# Altium project STM32F427IIH6.PrjPcb
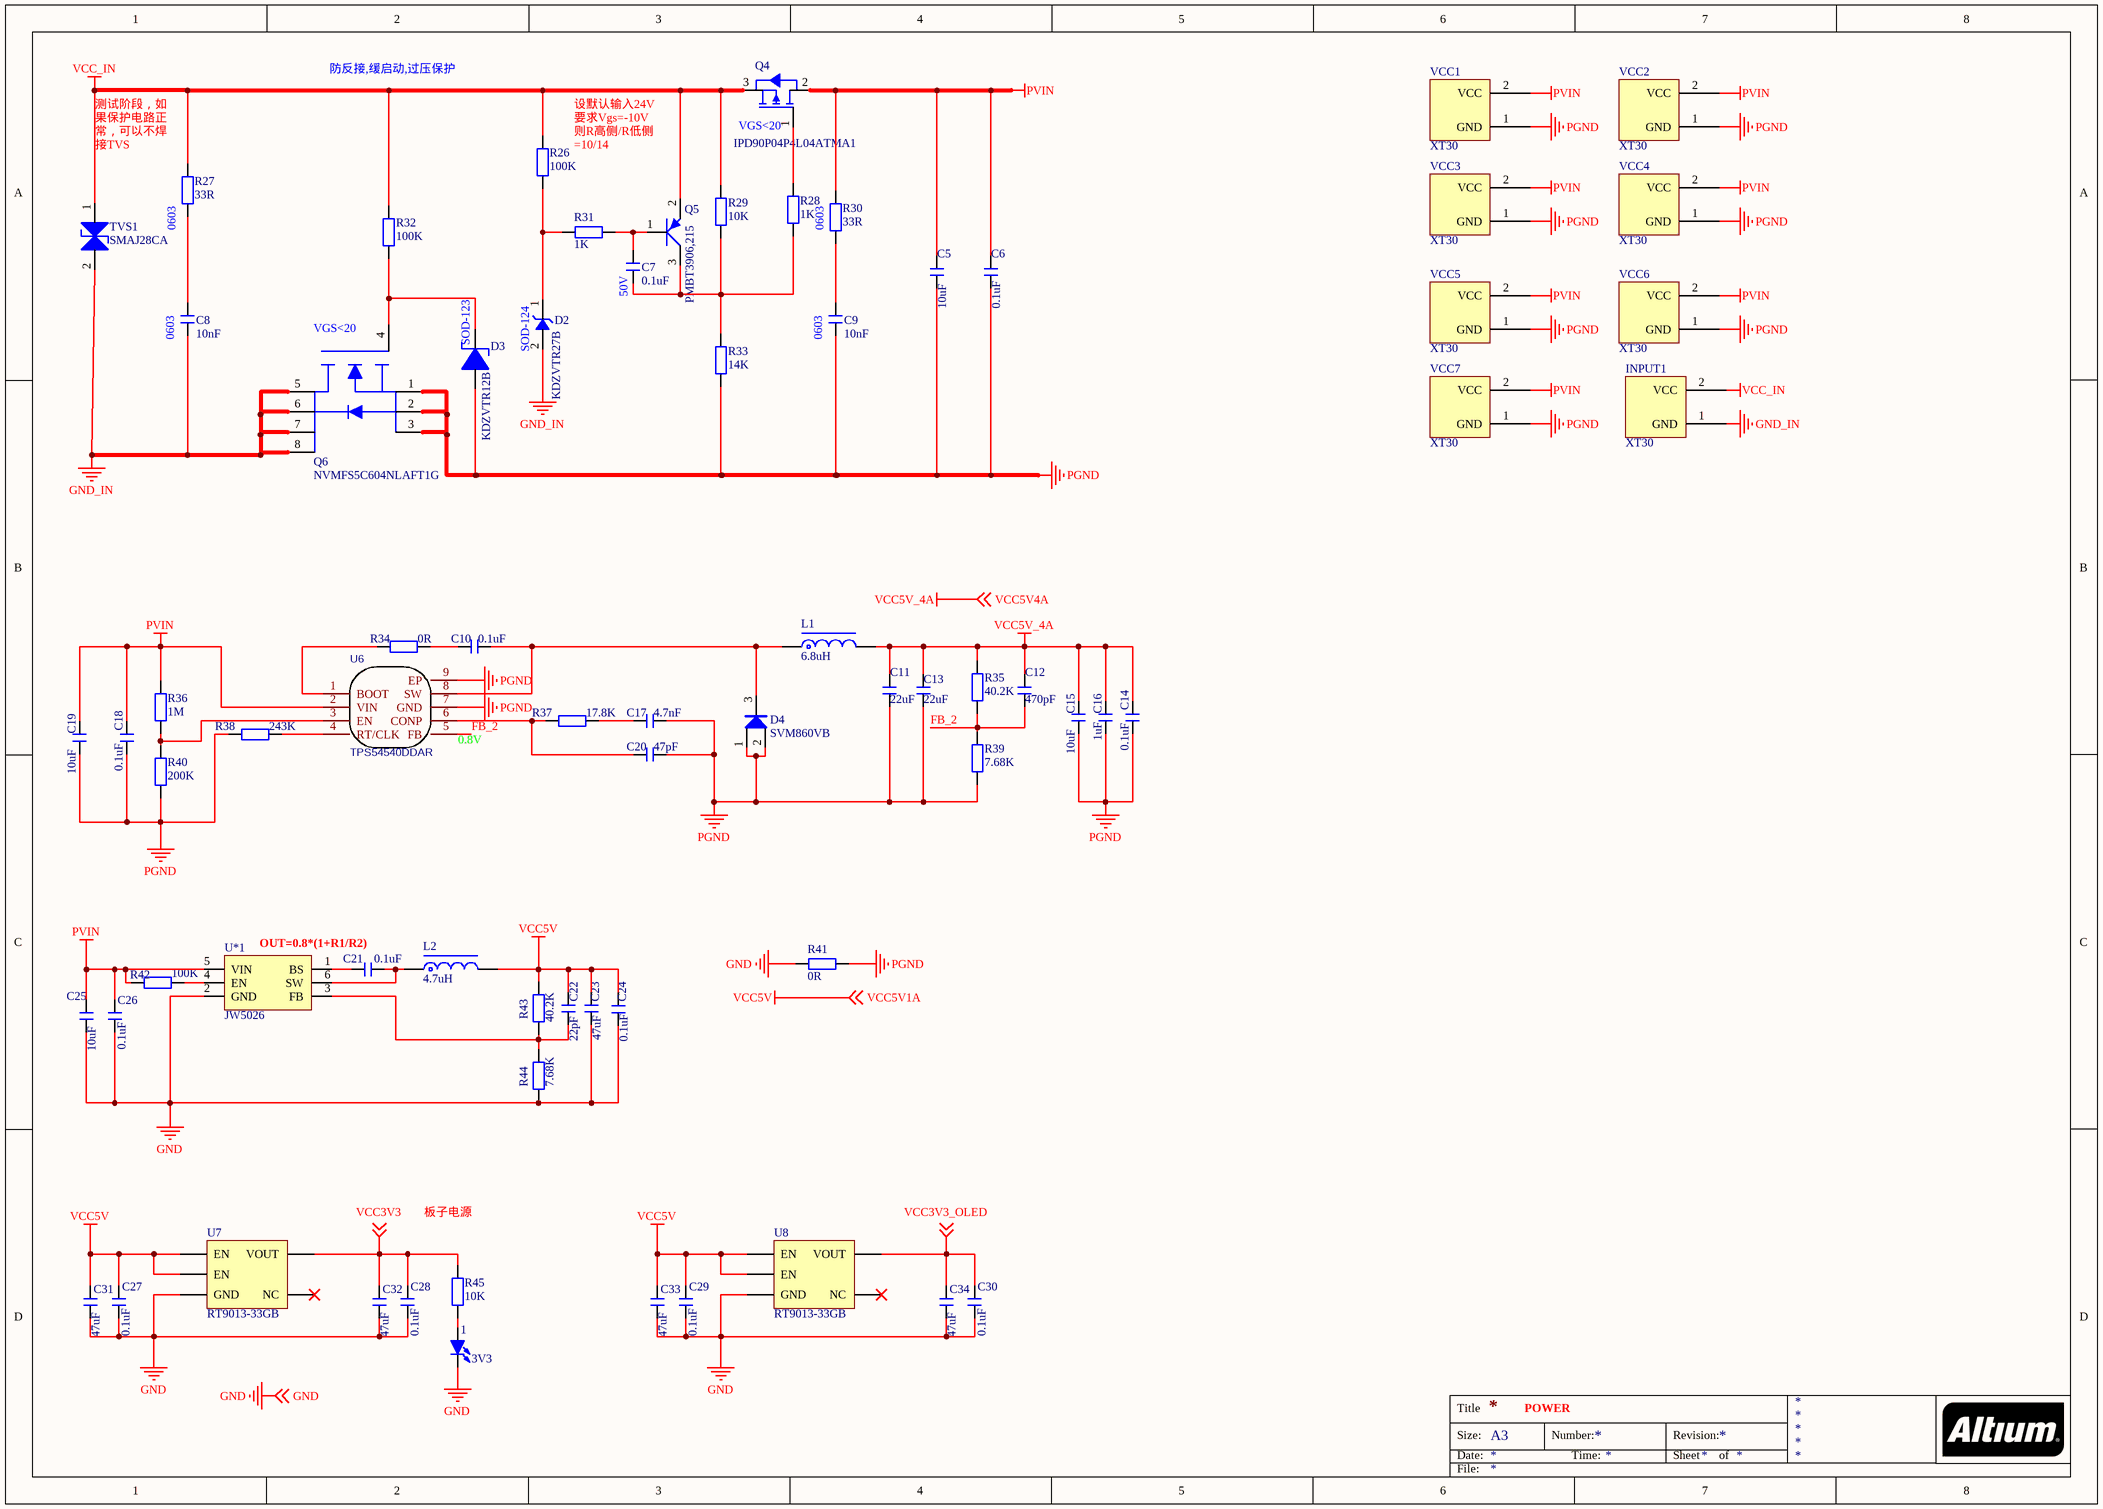
[diagram p0: Power.SchDoc]
1 sheet, 72 parts. Net scope: global (net labels, ports and power ports of the same name join across sheets).
Board file: STM32F427IIH6.PcbDoc

## Sheet Power.SchDoc
size A3

### Parts
1  3V3  [LED 0805R]
C5  10uF  [C 0805_L]
C6  0.1uF  [C 0805_L]
C7  0.1uF  [C 0402_L]
C8  10nF  [C 0402_L]
C9  10nF  [C 0402_L]
C10  0.1uF  [C 0402_L]
C11  22uF  [C 0805_L]
C12  470pF  [C 0402_L]
C13  22uF  [C 0805_L]
C14  0.1uF  [C 0805_L]
C15  10uF  [C 0805_L]
C16  1uF  [C 0805_L]
C17  4.7nF  [C 0402_L]
C18  0.1uF  [C 0805_L]
C19  10uF  [C 0805_L]
C20  47pF  [C 0402_L]
C21  0.1uF  [C 0402_L]
C22  22pF  [C 0402_L]
C23  47uF  [C 0805_L]
C24  0.1uF  [C 0805_L]
C25  10uF  [C 0805_L]
C26  0.1uF  [C 0805_L]
C27  0.1uF  [C 0805_L]
C28  0.1uF  [C 0805_L]
C29  0.1uF  [C 0805_L]
C30  0.1uF  [C 0805_L]
C31  47uF  [C 0805_L]
C32  47uF  [C 0805_L]
C33  47uF  [C 0805_L]
C34  47uF  [C 0805_L]
D2  KDZVTR27B  [SOD-123_L2.8-W1.8-LS3.7-RD]
D3  KDZVTR12B  [SOD-123_L2.8-W1.8-LS3.7-RD]
D4  SVM860VB  [TO-277B_3P-L6.1-W4.3-LS7.0-BR]
INPUT1  XT30  [XT30PW-M]
L1  6.8uH  [CDRH73]
L2  4.7uH  [CD53]
Q4  IPD90P04P4L04ATMA1  [PG-TO252-3]
Q5  PMBT3906,215  [SOT-23-3_L2.9-W1.3-P1.90-LS2.4-BR]
Q6  NVMFS5C604NLAFT1G  [PG-TDSON-8_L5.0-W6.0-P1.27-LS6.2-BL-EP]
R26  100K  [R 0402_L]
R27  33R  [R 0402_L]
R28  1K  [R 0402_L]
R29  10K  [R 0402_L]
R30  33R  [R 0402_L]
R31  1K  [R 0402_L]
R32  100K  [R 0402_L]
R33  14K  [R 0402_L]
R34  0R  [R 0402_L]
R35  40.2K  [R 0402_L]
R36  1M  [R 0402_L]
R37  17.8K  [R 0402_L]
R38  243K  [R 0402_L]
R39  7.68K  [R 0402_L]
R40  200K  [R 0402_L]
R41  0R  [R 0402_L]
R42  100K  [R 0402_L]
R43  40.2K  [R 0402_L]
R44  7.68K  [R 0402_L]
R45  10K  [R 0402_L]
TVS1  SMAJ28CA  [SMA(DO-214AC)]
U6  TPS54540DDAR  [TPS54540]
U7  RT9013-33GB  [SOT23-5M]
U8  RT9013-33GB  [SOT23-5M]
U*1  JW5026  [SOT-23-6_L2.9-W1.6-P0.95-LS2.8-BL]
VCC1  XT30  [XT30UPB-F]
VCC2  XT30  [XT30UPB-F]
VCC3  XT30  [XT30UPB-F]
VCC4  XT30  [XT30UPB-F]
VCC5  XT30  [XT30UPB-F]
VCC6  XT30  [XT30UPB-F]
VCC7  XT30  [XT30UPB-F]

### Nets
GND: 1.2(K) C23.1 C24.1 C25.1 C26.1 C27.1 C28.1 C29.1 C30.1 C31.1 C32.1 C33.1 C34.1 R41.1 R44.1 U7.2(GND) U8.2(GND) U*1.2(GND) ; off-sheet GND
GND_IN: C8.1 D2.2 INPUT1.1(GND) Q6.5 Q6.6 Q6.7 Q6.8 TVS1.2
PGND: C5.2 C6.2 C9.1 C11.1 C13.1 C14.1 C15.1 C16.1 C17.2 C18.1 C19.1 C20.2 D3.2 D4.1(A) D4.2(K) Q6.1 Q6.2 Q6.3 R33.1 R38.2 R39.1 R40.1 R41.2 U6.7(GND) U6.9(EP) VCC1.1(GND) VCC2.1(GND) VCC3.1(GND) VCC4.1(GND) VCC5.1(GND) VCC6.1(GND) VCC7.1(GND)
PVIN: C5.1 C6.1 C18.2 C19.2 C25.2 C26.2 Q4.2 R30.2 R36.2 R42.2 U6.2(VIN) U*1.5(VIN) VCC1.2(VCC) VCC2.2(VCC) VCC3.2(VCC) VCC4.2(VCC) VCC5.2(VCC) VCC6.2(VCC) VCC7.2(VCC)
VCC5V: C22.2 C23.2 C24.2 C27.2 C29.2 C31.2 C33.2 L2.2 R43.2 U7.1(EN) U7.3(EN) U8.1(EN) U8.3(EN) ; off-sheet VCC5V1A  [also labelled VCC5V1A]
VCC5V_4A: C11.2 C12.2 C13.2 C14.2 C15.2 C16.2 L1.2 R35.2 ; off-sheet VCC5V4A  [also labelled VCC5V4A]
VCC_IN: INPUT1.2(VCC) Q4.3 Q5.2 R26.2 R27.2 R29.2 R32.2 TVS1.1
FB_2: C12.1 R35.1 R39.2 U6.5(FB)
VCC3V3: C28.2 C32.2 R45.1 U7.5(VOUT) ; off-sheet VCC3V3
VCC3V3_OLED: C30.2 C34.2 U8.5(VOUT) ; off-sheet VCC3V3_OLED
Net1_1: 1.1(A) R45.2
NetC7_1: C7.1 Q5.3 R28.1 R29.1 R33.2
NetC7_2: C7.2 Q5.1 R31.1
NetC8_2: C8.2 R27.1
NetC9_2: C9.2 R30.1
NetC10_1: C10.1 R34.1
NetC10_2: C10.2 D4.3 L1.1 U6.8(SW)
NetC17_1: C17.1 R37.1
NetC20_1: C20.1 R37.2 U6.6(CONP)
NetC21_1: C21.1 U*1.1(BS)
NetC21_2: C21.2 L2.1 U*1.6(SW)
NetC22_1: C22.1 R43.1 R44.2 U*1.3(FB)
NetD2_1: D2.1 R26.1 R31.2
NetD3_1: D3.1 Q6.4 R32.1
NetQ4_1: Q4.1 R28.2
NetR34_2: R34.2 U6.1(BOOT)
NetR36_1: R36.1 R40.2 U6.3(EN)
NetR38_1: R38.1 U6.4(RT/CLK)
NetR42_1: R42.1 U*1.4(EN)

Not connected (* = marked no-connect by the designer): U7 4(NC)*; U8 4(NC)*

### Notes on the sheet
- 防反接,缓启动,过压保护
- (near R27) 测试阶段，如果保护电路正常，可以不焊接TVS
- (near R26) 设默认输入24V
  要求Vgs=-10V
  则R高侧/R低侧=10/14
- (near Q4) VGS<20
- (near R27) 0603
- (near R30) 0603
- (near C7) 50V
- (near C8) 0603
- (near Q6) VGS<20
- (near D3) SOD-123
- (near D2) SOD-124
- (near C9) 0603
- (near U6) 0.8V
- OUT=0.8*(1+R1/R2)
- 板子电源
- POWER
- Title
- Size:
- Date:
- A3
- Number:
- Time:
- Revision:
- Sheet
- of
- File:

### Library data of the parts
1 = LED-SMD: 贴片LED
C5-C34 = C: 贴片电容
D2 = BZD27C30P
D4 = SVM860VB: TO-277B系列,SVM860VB-8A
L1 = L-CDRH: 功率屏蔽电感
L2 = L-SMD: CD系列贴片线绕功率电感
Q4 = IPD90P04P4
Q6 = BSC037N08NS5ATMA1
R26-R45 = R: 贴片电阻
U6 = TPS54540DDAR: BOM_Manufacturer: TI; SMT Type: Extend; BOM_Supplier: LCSC; BOM_Manufacturer Part: TPS54540DDAR; BOM_Supplier Part: C95286; BOM_LCSC Assembly: Yes; spicePre: U
U*1 = JW5026 : BUCK、MAX40V